# Altium schematic sheet PCIe_to_M2E.SchDoc
size C
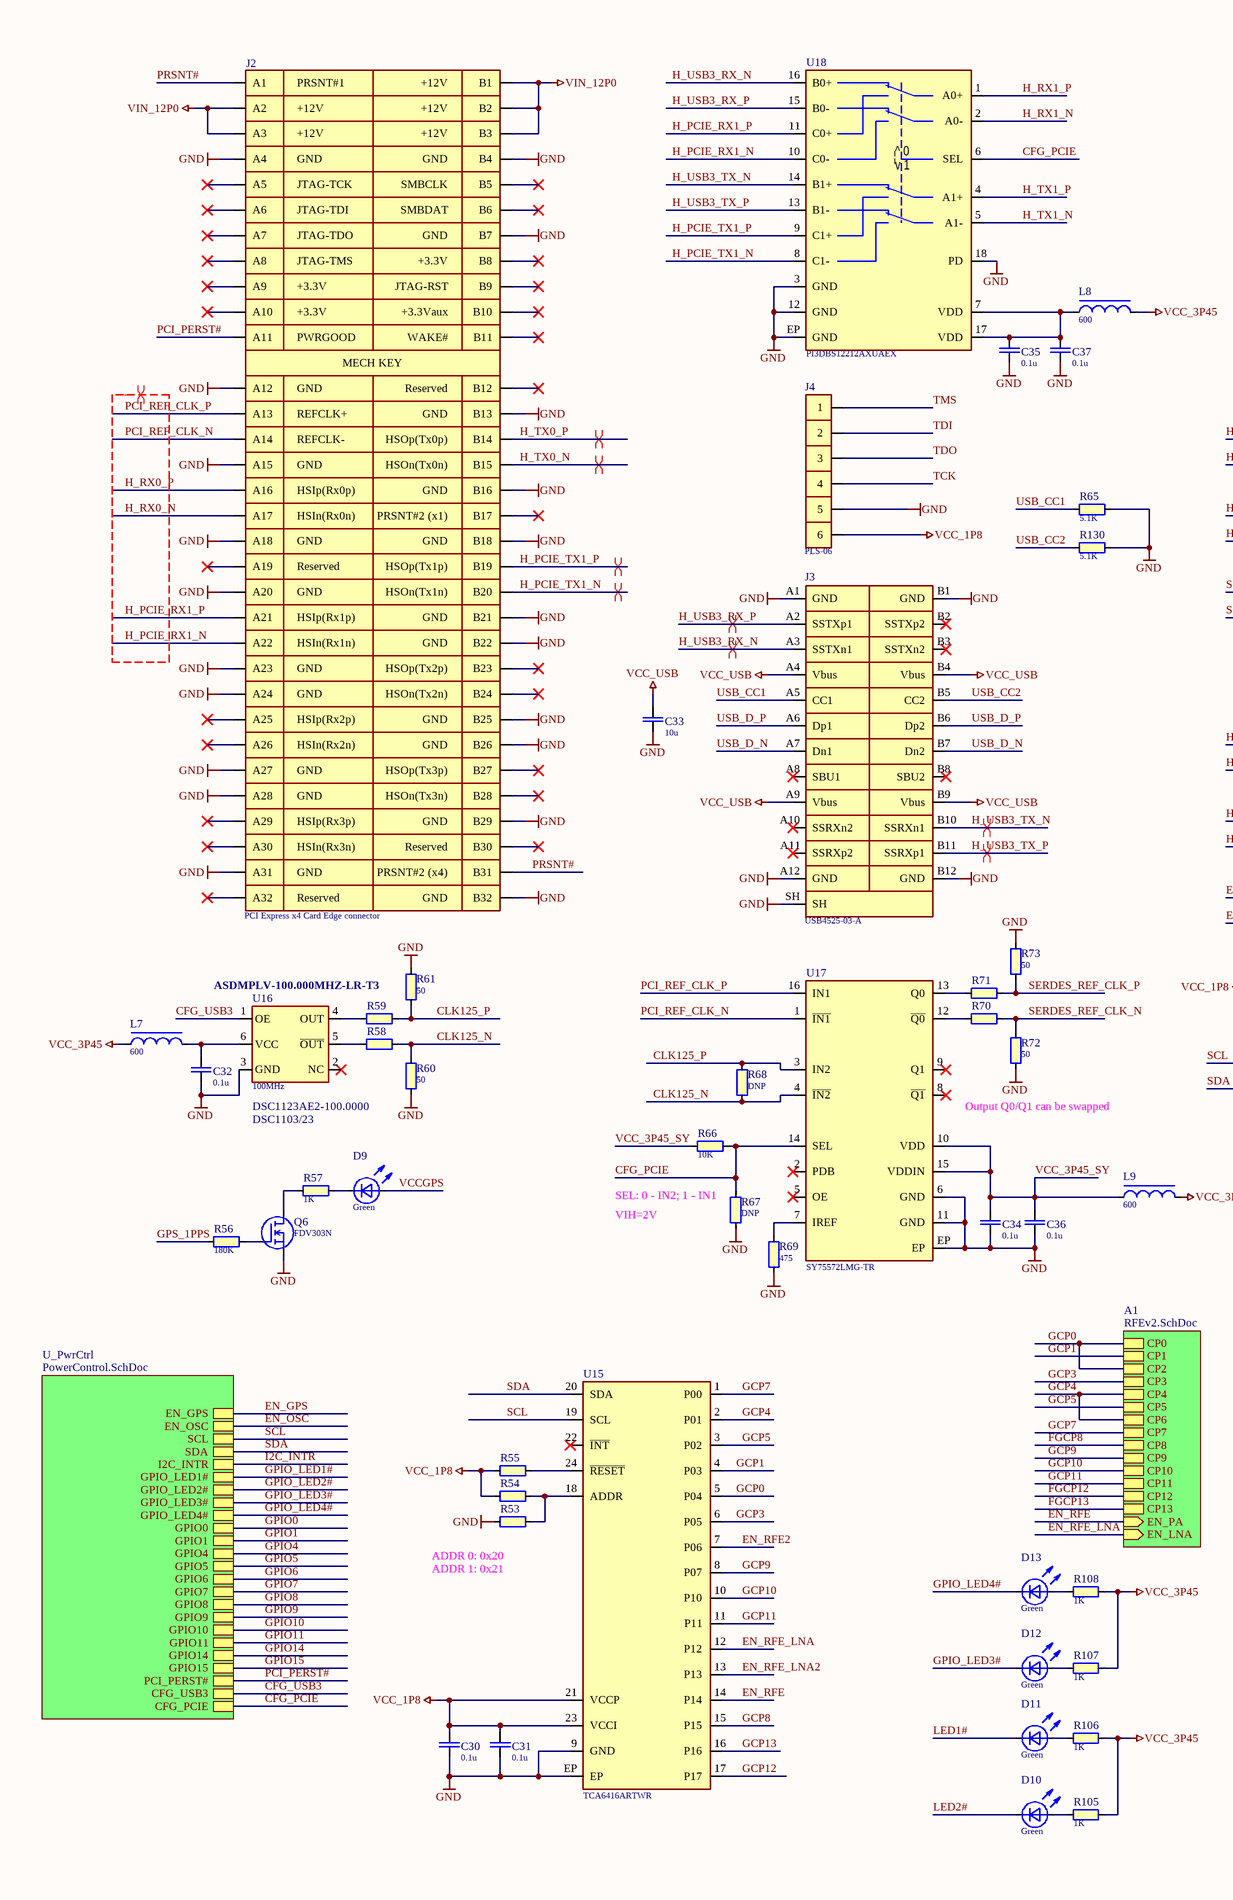
[diagram p0: PCIe_to_M2E.SchDoc, left]
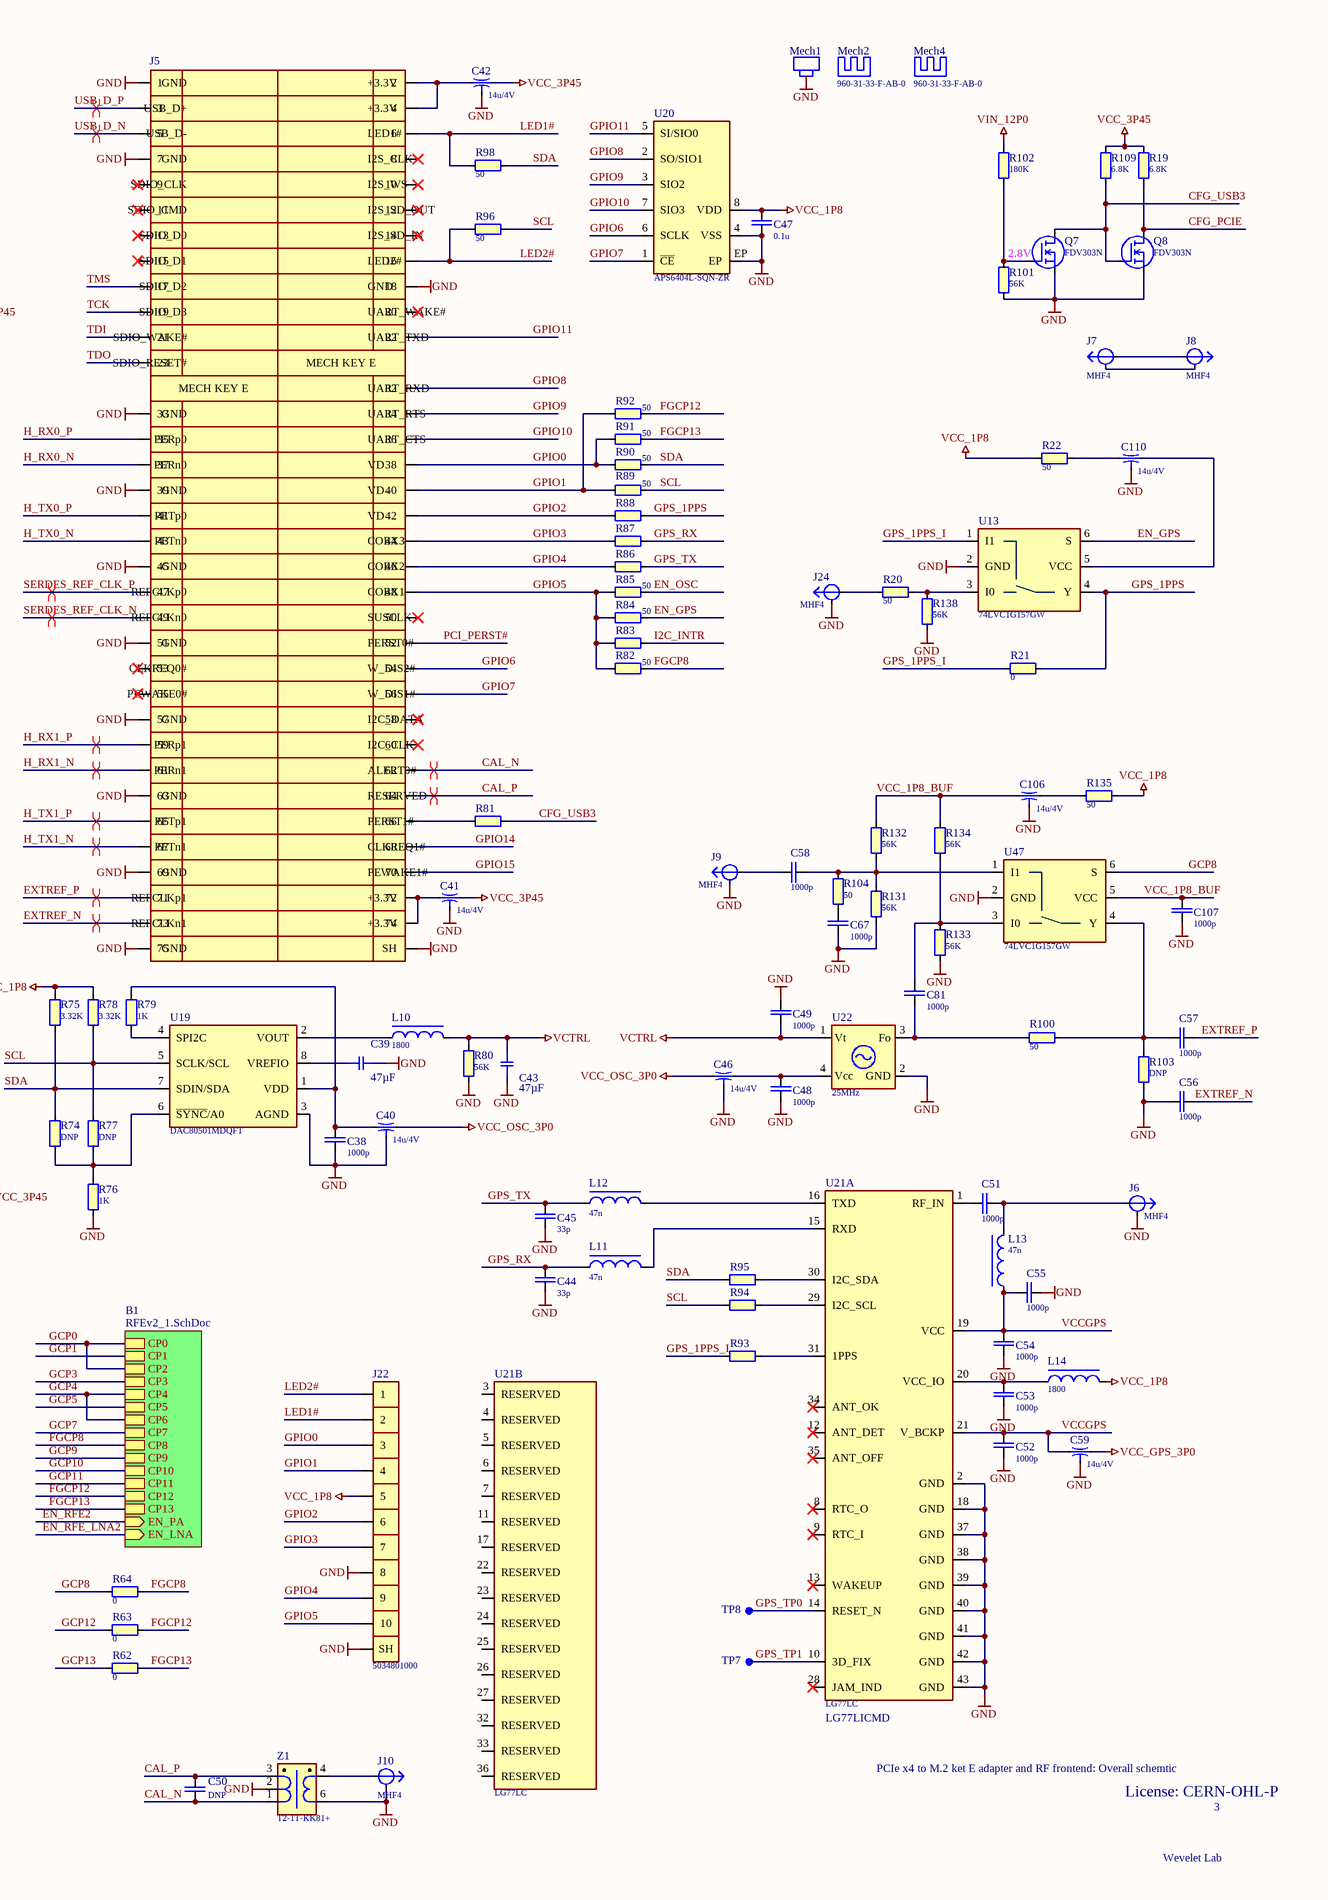
[diagram p1: PCIe_to_M2E.SchDoc, right]

## Parts
C30  value 0.1u  [CAPC100X50X55L25N]  (hidden comment: GRM155R71E104KE14D)
C31  value 0.1u  [CAPC100X50X55L25N]  (hidden comment: GRM155R71E104KE14D)
C32  value 0.1u  [CAPC100X50X55L25N]  (hidden comment: GRM155R71E104KE14D)
C33  value 10u  [CAPC160X80X100L40N]  (hidden comment: Cap-0603-X5R-25V-10u-20%)
C34  value 0.1u  [CAPC100X50X55L25N]  (hidden comment: GRM155R71E104KE14D)
C35  value 0.1u  [CAPC100X50X55L25N]  (hidden comment: GRM155R71E104KE14D)
C36  value 0.1u  [CAPC100X50X55L25N]  (hidden comment: GRM155R71E104KE14D)
C37  value 0.1u  [CAPC100X50X55L25N]  (hidden comment: GRM155R71E104KE14D)
C38  value 1000p  [CAPC100X50X55L25N]  (hidden comment: Cap-0402-NP0-50V-1000p-20%)
C39  value 47µF  [SMD-0603-CAP_HighDensity]  (hidden comment: GRM188C80G476ME01D)
C40  value 14u/4V  [CAPCEMI100X50X50L20N]  (hidden comment: NFM15PC146R0G3D)
C41  value 14u/4V  [CAPCEMI100X50X50L20N]  (hidden comment: NFM15PC146R0G3D)
C42  value 14u/4V  [CAPCEMI100X50X50L20N]  (hidden comment: NFM15PC146R0G3D)
C43  value 47µF  [SMD-0603-CAP_HighDensity]  (hidden comment: GRM188C80G476ME01D)
C44  value 33p  [CAPC100X50X55L25N]  (hidden comment: Cap-0402-NP0-50V-33p-20%)
C45  value 33p  [CAPC100X50X55L25N]  (hidden comment: Cap-0402-NP0-50V-33p-20%)
C46  value 14u/4V  [CAPCEMI100X50X50L20N]  (hidden comment: NFM15PC146R0G3D)
C47  value 0.1u  [CAPC100X50X55L25N]  (hidden comment: GRM155R71E104KE14D)
C48  value 1000p  [CAPC100X50X55L25N]  (hidden comment: Cap-0402-NP0-50V-1000p-20%)
C49  value 1000p  [CAPC100X50X55L25N]  (hidden comment: Cap-0402-NP0-50V-1000p-20%)
C50  value DNP  [CAPC100X50X55L25N]  (hidden comment: Cap-0402-DNP)  (no BOM)
C51  value 1000p  [CAPC100X50X55L25N]  (hidden comment: Cap-0402-NP0-50V-1000p-20%)
C52  value 1000p  [CAPC100X50X55L25N]  (hidden comment: Cap-0402-NP0-50V-1000p-20%)
C53  value 1000p  [CAPC100X50X55L25N]  (hidden comment: Cap-0402-NP0-50V-1000p-20%)
C54  value 1000p  [CAPC100X50X55L25N]  (hidden comment: Cap-0402-NP0-50V-1000p-20%)
C55  value 1000p  [CAPC100X50X55L25N]  (hidden comment: Cap-0402-NP0-50V-1000p-20%)
C56  value 1000p  [CAPC100X50X55L25N]  (hidden comment: Cap-0402-NP0-50V-1000p-20%)
C57  value 1000p  [CAPC100X50X55L25N]  (hidden comment: Cap-0402-NP0-50V-1000p-20%)
C58  value 1000p  [CAPC100X50X55L25N]  (hidden comment: Cap-0402-NP0-50V-1000p-20%)
C59  value 14u/4V  [CAPCEMI100X50X50L20N]  (hidden comment: NFM15PC146R0G3D)
C67  value 1000p  [CAPC100X50X55L25N]  (hidden comment: Cap-0402-NP0-50V-1000p-20%)
C81  value 1000p  [CAPC100X50X55L25N]  (hidden comment: Cap-0402-NP0-50V-1000p-20%)
C106  value 14u/4V  [CAPCEMI100X50X50L20N]  (hidden comment: NFM15PC146R0G3D)
C107  value 1000p  [CAPC100X50X55L25N]  (hidden comment: Cap-0402-NP0-50V-1000p-20%)
C110  value 14u/4V  [CAPCEMI100X50X50L20N]  (hidden comment: NFM15PC146R0G3D)
D9  value Green  [LEDC160X80X80L40N-Green]  (hidden comment: LTST-C190KGKT)
D10  value Green  [LEDC160X80X80L40N-Green]  (hidden comment: LTST-C190KGKT)
D11  value Green  [LEDC160X80X80L40N-Green]  (hidden comment: LTST-C190KGKT)
D12  value Green  [LEDC160X80X80L40N-Green]  (hidden comment: LTST-C190KGKT)
D13  value Green  [LEDC160X80X80L40N-Green]  (hidden comment: LTST-C190KGKT)
J2  value PCI Express x4 Card Edge connector  [EDGE_CONN_PCIe_x4]  (hidden comment: Edge connector PCIe x4 Card)  (no BOM)
J3  USB4525-03-A  [GCT_USB4525-03-A]
J4  PLS-06  [PLS-06]
J5  SM3ZS067U215AER1500  [JAE_SM3ZS067U215AER1500]  (value not drawn)
J6  value MHF4  [LINX_CONMHF4-SMD-G-T]  (hidden comment: CONMHF4-SMD-G-T)
J7  value MHF4  [LINX_CONMHF4-SMD-G-T]  (hidden comment: CONMHF4-SMD-G-T)
J8  value MHF4  [LINX_CONMHF4-SMD-G-T]  (hidden comment: CONMHF4-SMD-G-T)
J9  value MHF4  [LINX_CONMHF4-SMD-G-T]  (hidden comment: CONMHF4-SMD-G-T)
J10  value MHF4  [LINX_CONMHF4-SMD-G-T]  (hidden comment: CONMHF4-SMD-G-T)
J22  5034801000  [MOLEX_5034801000]
J24  value MHF4  [LINX_CONMHF4-SMD-G-T]  (hidden comment: CONMHF4-SMD-G-T)
L7  value 600  [INDC100X60X60L30N]  (hidden comment: BLM15HG601SN1D)
L8  value 600  [INDC100X60X60L30N]  (hidden comment: BLM15HG601SN1D)
L9  value 600  [INDC100X60X60L30N]  (hidden comment: BLM15HG601SN1D)
L10  value 1800  [INDC100X60X60L30N]  (hidden comment: BLM15HD182SN1D)
L11  value 47n  [INDC100X60X60L30N]  (hidden comment: LQW15AN47NJ8ZD)
L12  value 47n  [INDC100X60X60L30N]  (hidden comment: LQW15AN47NJ8ZD)
L13  value 47n  [INDC100X60X60L30N]  (hidden comment: LQW15AN47NJ8ZD)
L14  value 1800  [INDC100X60X60L30N]  (hidden comment: BLM15HD182SN1D)
Mech1  SM3ZS067U215-NUT1-R2500  [JAE_SM3ZS067U215-NUT1]  (value not drawn)
Mech2  960-31-33-F-AB-0  [WAKEFIELD_960-31-33-F-AB-0]
Mech4  960-31-33-F-AB-0  [WAKEFIELD_960-31-33-F-AB-0]
Q6  FDV303N  [SOT23-3P95_245X110L45X44N]
Q7  FDV303N  [SOT23-3P95_245X110L45X44N]
Q8  FDV303N  [SOT23-3P95_245X110L45X44N]
R19  value 6.8K  [RESC100X50X40L20N]  (hidden comment: RC0402FR-076K8L)
R20  value 50  [RESC100X50X40L20N]  (hidden comment: RC0402FR-0750RL)
R21  value 0  [RESC100X50X40L20N]  (hidden comment: RC0402JR-070RL)
R22  value 50  [RESC100X50X40L20N]  (hidden comment: RC0402FR-0750RL)
R53  value 33  [RESC100X50X40L20N]  (hidden comment: RC0402FR-0733RL)
R54  value 0  [RESC100X50X40L20N]  (hidden comment: RC0402JR-070RL)
R55  value 6.8K  [RESC100X50X40L20N]  (hidden comment: RC0402FR-076K8L)
R56  value 180K  [RESC100X50X40L20N]  (hidden comment: RC0402FR-07180KL)
R57  value 1K  [RESC100X50X40L20N]  (hidden comment: RC0402FR-071KL)
R58  value 33  [RESC100X50X40L20N]  (hidden comment: RC0402FR-0733RL)
R59  value 33  [RESC100X50X40L20N]  (hidden comment: RC0402FR-0733RL)
R60  value 50  [RESC100X50X40L20N]  (hidden comment: RC0402FR-0750RL)
R61  value 50  [RESC100X50X40L20N]  (hidden comment: RC0402FR-0750RL)
R62  value 0  [RESC100X50X40L20N]  (hidden comment: RC0402JR-070RL)
R63  value 0  [RESC100X50X40L20N]  (hidden comment: RC0402JR-070RL)
R64  value 0  [RESC100X50X40L20N]  (hidden comment: RC0402JR-070RL)
R65  value 5.1K  [RESC100X50X40L20N]  (hidden comment: RC0402FR-075K1L)
R66  value 10K  [RESC100X50X40L20N]  (hidden comment: RC0402FR-0710KL)
R67  value DNP  [RESC100X50X40L20N]  (hidden comment: Res-0402-DNP)  (no BOM)
R68  value DNP  [RESC100X50X40L20N]  (hidden comment: Res-0402-DNP)  (no BOM)
R69  value 475  [RESC100X50X40L20N]  (hidden comment: RC0402FR-07475RL)
R70  value 33  [RESC100X50X40L20N]  (hidden comment: RC0402FR-0733RL)
R71  value 33  [RESC100X50X40L20N]  (hidden comment: RC0402FR-0733RL)
R72  value 50  [RESC100X50X40L20N]  (hidden comment: RC0402FR-0750RL)
R73  value 50  [RESC100X50X40L20N]  (hidden comment: RC0402FR-0750RL)
R74  value DNP  [RESC100X50X40L20N]  (hidden comment: Res-0402-DNP)  (no BOM)
R75  value 3.32K  [RESC100X50X40L20N]  (hidden comment: RC0402FR-073K32L)
R76  value 1K  [RESC100X50X40L20N]  (hidden comment: RC0402FR-071KL)
R77  value DNP  [RESC100X50X40L20N]  (hidden comment: Res-0402-DNP)  (no BOM)
R78  value 3.32K  [RESC100X50X40L20N]  (hidden comment: RC0402FR-073K32L)
R79  value 1K  [RESC100X50X40L20N]  (hidden comment: RC0402FR-071KL)
R80  value 56K  [RESC100X50X40L20N]  (hidden comment: RC0402FR-0756KL)
R81  value 50  [RESC100X50X40L20N]  (hidden comment: RC0402FR-0750RL)
R82  value 50  [RESC100X50X40L20N]  (hidden comment: RC0402FR-0750RL)
R83  value 50  [RESC100X50X40L20N]  (hidden comment: RC0402FR-0750RL)
R84  value 50  [RESC100X50X40L20N]  (hidden comment: RC0402FR-0750RL)
R85  value 50  [RESC100X50X40L20N]  (hidden comment: RC0402FR-0750RL)
R86  value 50  [RESC100X50X40L20N]  (hidden comment: RC0402FR-0750RL)
R87  value 50  [RESC100X50X40L20N]  (hidden comment: RC0402FR-0750RL)
R88  value 50  [RESC100X50X40L20N]  (hidden comment: RC0402FR-0750RL)
R89  value 50  [RESC100X50X40L20N]  (hidden comment: RC0402FR-0750RL)
R90  value 50  [RESC100X50X40L20N]  (hidden comment: RC0402FR-0750RL)
R91  value 50  [RESC100X50X40L20N]  (hidden comment: RC0402FR-0750RL)
R92  value 50  [RESC100X50X40L20N]  (hidden comment: RC0402FR-0750RL)
R93  value 50  [RESC100X50X40L20N]  (hidden comment: RC0402FR-0750RL)
R94  value 50  [RESC100X50X40L20N]  (hidden comment: RC0402FR-0750RL)
R95  value 50  [RESC100X50X40L20N]  (hidden comment: RC0402FR-0750RL)
R96  value 50  [RESC100X50X40L20N]  (hidden comment: RC0402FR-0750RL)
R98  value 50  [RESC100X50X40L20N]  (hidden comment: RC0402FR-0750RL)
R100  value 50  [RESC100X50X40L20N]  (hidden comment: RC0402FR-0750RL)
R101  value 56K  [RESC100X50X40L20N]  (hidden comment: RC0402FR-0756KL)
R102  value 180K  [RESC100X50X40L20N]  (hidden comment: RC0402FR-07180KL)
R103  value DNP  [RESC100X50X40L20N]  (hidden comment: Res-0402-DNP)  (no BOM)
R104  value 50  [RESC100X50X40L20N]  (hidden comment: RC0402FR-0750RL)
R105  value 1K  [RESC100X50X40L20N]  (hidden comment: RC0402FR-071KL)
R106  value 1K  [RESC100X50X40L20N]  (hidden comment: RC0402FR-071KL)
R107  value 1K  [RESC100X50X40L20N]  (hidden comment: RC0402FR-071KL)
R108  value 1K  [RESC100X50X40L20N]  (hidden comment: RC0402FR-071KL)
R109  value 6.8K  [RESC100X50X40L20N]  (hidden comment: RC0402FR-076K8L)
R130  value 5.1K  [RESC100X50X40L20N]  (hidden comment: RC0402FR-075K1L)
R131  value 56K  [RESC100X50X40L20N]  (hidden comment: RC0402FR-0756KL)
R132  value 56K  [RESC100X50X40L20N]  (hidden comment: RC0402FR-0756KL)
R133  value 56K  [RESC100X50X40L20N]  (hidden comment: RC0402FR-0756KL)
R134  value 56K  [RESC100X50X40L20N]  (hidden comment: RC0402FR-0756KL)
R135  value 50  [RESC100X50X40L20N]  (hidden comment: RC0402FR-0750RL)
R138  value 56K  [RESC100X50X40L20N]  (hidden comment: RC0402FR-0756KL)
TP7  TP100  [TP100]  (value not drawn)  (no BOM)
TP8  TP100  [TP100]  (value not drawn)  (no BOM)
U13  74LVC1G157GW  [SOT363-2P95_200X125L45X40N]
U15  TCA6416ARTWR  [QFN25P50_400X400X80L40X24T250N]
U16  value 100MHz  [ABRACON_AK2A]  (hidden comment: AK2ADDF1-100.000T)
U17  SY75572LMG-TR  [QFN17P50_300X300X100L40X24T170N]
U18  PI3DBS12212AXUAEX  [QFN19P40_200X200X40L25X20T100N]
U19  DAC80501MDQFT  [SON8P50_200X200X80L50X25N]
U20  APS6404L-SQN-ZR  [PSON9P50_200X300X50L45X25T160X20N]
U21  value LG77LC  [QUECTEL_LG77LC]  (hidden comment: LG77LICMD)  (parts A,B of 2)
U22  value 25MHz  [OSCCC320X250X100L70X80N]  (hidden comment: TXEAADSANF-25.000000)
U47  74LVC1G157GW  [SOT363-2P95_200X125L45X40N]
Z1  T2-1T-KK81+  [Mini-Circuits_KK81]

## Sub-sheets
A1 = RFEv2.SchDoc: CP0, CP1, CP3, CP2, CP4, CP5, CP6, CP7, CP9, CP10, CP11, CP12, CP13, CP8, EN_PA (in), EN_LNA (in)
B1 = RFEv2_1.SchDoc: CP0, CP1, CP3, CP2, CP4, CP5, CP6, CP7, CP9, CP10, CP11, CP12, CP13, CP8, EN_PA (in), EN_LNA (in)
U_PwrCtrl = PowerControl.SchDoc: EN_GPS, EN_OSC, SCL, SDA, I2C_INTR, GPIO_LED1#, GPIO_LED2#, GPIO_LED3#, GPIO_LED4#, GPIO0, GPIO1, GPIO4, GPIO5, GPIO6, GPIO7, GPIO8, GPIO9, GPIO10, GPIO11, GPIO14, GPIO15, PCI_PERST#, CFG_USB3, CFG_PCIE

## Nets
GND: C30.2 C31.2 C32.2 C33.2 C34.2 C35.2 C36.2 C37.2 C38.1 C39.2 C40.2(GND) C41.2(GND) C42.2(GND) C43.2 C44.2 C45.2 C46.2(GND) C47.2 C48.1 C49.2 C52.2 C53.1 C54.2 C55.1 C56.1 C59.2(GND) C67.2 C106.2(GND) C107.1 C110.2(GND) J2.A4 J2.A12 J2.A15 J2.A18 J2.A20 J2.A23 J2.A24 J2.A27 J2.A28 J2.A31 J2.B4 J2.B7 J2.B13 J2.B16 J2.B18 J2.B21 J2.B22 J2.B25 J2.B26 J2.B29 J2.B32 J3.A1(GND) J3.A12(GND) J3.B1(GND) J3.B12(GND) J3.SH J4.5 J5.1 J5.7 J5.18 J5.33 J5.39 J5.45 J5.51 J5.57 J5.63 J5.69 J5.75 J5.SH J6.SH J9.SH J10.SH J22.8 J22.SH J24.SH Mech1.SH Q6.2(S) Q7.2(S) Q8.2(S) R53.1 R60.1 R61.2 R65.2 R67.1 R69.1 R72.1 R73.2 R76.1 R80.2 R101.1 R103.1 R130.2 R131.2 R133.2 R138.2 U13.2(GND) U15.9(GND) U15.EP U16.3(GND) U17.6(GND) U17.11(GND) U17.EP U18.3(GND) U18.12(GND) U18.18(PD) U18.EP(GND) U19.3(AGND) U20.4(VSS) U20.EP U21.2(GND) U21.18(GND) U21.37(GND) U21.38(GND) U21.39(GND) U21.40(GND) U21.41(GND) U21.42(GND) U21.43(GND) U22.2(GND) U47.2(GND) Z1.2(SEC-CT) Z1.6(PRI)
VCC_1P8: C30.1 C31.1 C47.1 J4.6 J22.5 L14.2 R22.2 R54.1 R55.1 R75.2 R78.2 R135.1 U15.21(VCCP) U15.23(VCCI) U20.8(VDD)
VCC_3P45: C41.3 C42.3 L7.1 L8.2 L9.2 R19.2 R105.2 R106.2 R107.2 R108.2 R109.2
VCC_GPS_3P0: C59.3
VCC_OSC_3P0: C40.3 C46.1
VCC_USB: C33.1 J3.A4(Vbus) J3.A9(Vbus) J3.B4(Vbus) J3.B9(Vbus)
VCTRL: C43.1 C49.1 L10.2 R80.1 U22.1(Vt)
VIN_12P0: J2.A2 J2.A3 J2.B1 J2.B2 J2.B3 R102.2
CAL_N: C50.2 J5.62 Z1.1(SEC)
CAL_P: C50.1 J5.64 Z1.3(SEC-DOT)
CFG_PCIE: Q8.3(D) R19.1 R66.1 R67.2 U17.14(SEL) U18.6(SEL) ; sheet U_PwrCtrl/CFG_PCIE
CFG_USB3: Q7.3(D) Q8.1(G) R81.2 R109.1 U16.1(OE) ; sheet U_PwrCtrl/CFG_USB3
CLK125_N: R58.2 R60.2 R68.1 U17.4(~{IN2})
CLK125_P: R59.2 R61.1 R68.2 U17.3(IN2)
EN_GPS: R84.2 U13.6(S) ; sheet U_PwrCtrl/EN_GPS
EN_OSC: R85.2 ; sheet U_PwrCtrl/EN_OSC
EN_RFE: U15.14(P14) ; sheet A1/EN_PA
EN_RFE2: U15.7(P06) ; sheet B1/EN_PA
EN_RFE_LNA: U15.12(P12) ; sheet A1/EN_LNA
EN_RFE_LNA2: U15.13(P13) ; sheet B1/EN_LNA
EXTREF_N: C56.2 J5.73
EXTREF_P: C57.2 J5.71
FGCP8: R64.2 R82.2 ; sheet A1/CP8, sheet B1/CP8
FGCP12: R63.2 R92.2 ; sheet A1/CP12, sheet B1/CP12
FGCP13: R62.2 R91.2 ; sheet A1/CP13, sheet B1/CP13
GCP0: U15.5(P04) ; sheet A1/CP0, sheet A1/CP2, sheet B1/CP0, sheet B1/CP2
GCP1: U15.4(P03) ; sheet A1/CP1, sheet B1/CP1
GCP3: U15.6(P05) ; sheet A1/CP3, sheet B1/CP3
GCP4: U15.2(P01) ; sheet A1/CP4, sheet A1/CP6, sheet B1/CP4, sheet B1/CP6
GCP5: U15.3(P02) ; sheet A1/CP5, sheet B1/CP5
GCP7: U15.1(P00) ; sheet A1/CP7, sheet B1/CP7
GCP8: R64.1 U15.15(P15) U47.6(S)
GCP9: U15.8(P07) ; sheet A1/CP9, sheet B1/CP9
GCP10: U15.10(P10) ; sheet A1/CP10, sheet B1/CP10
GCP11: U15.11(P11) ; sheet A1/CP11, sheet B1/CP11
GCP12: R63.1 U15.17(P17)
GCP13: R62.1 U15.16(P16)
GPIO0: J5.38 J22.3 R90.1 R91.1 ; sheet U_PwrCtrl/GPIO0
GPIO1: J5.40 J22.4 R89.1 R92.1 ; sheet U_PwrCtrl/GPIO1
GPIO2: J5.42 J22.6 R88.1
GPIO3: J5.44 J22.7 R87.1
GPIO4: J5.46 J22.9 R86.1 ; sheet U_PwrCtrl/GPIO4
GPIO5: J5.48 J22.10 R82.1 R83.1 R84.1 R85.1 ; sheet U_PwrCtrl/GPIO5
GPIO6: J5.54 U20.6(SCLK) ; sheet U_PwrCtrl/GPIO6
GPIO7: J5.56 U20.1(~{CE}) ; sheet U_PwrCtrl/GPIO7
GPIO8: J5.32 U20.2(SO/SIO1) ; sheet U_PwrCtrl/GPIO8
GPIO9: J5.34 U20.3(SIO2) ; sheet U_PwrCtrl/GPIO9
GPIO10: J5.36 U20.7(SIO3) ; sheet U_PwrCtrl/GPIO10
GPIO11: J5.22 U20.5(SI/SIO0) ; sheet U_PwrCtrl/GPIO11
GPIO14: J5.68 ; sheet U_PwrCtrl/GPIO14
GPIO15: J5.70 ; sheet U_PwrCtrl/GPIO15
GPIO_LED1#: sheet U_PwrCtrl/GPIO_LED1#
GPIO_LED2#: sheet U_PwrCtrl/GPIO_LED2#
GPIO_LED3#: D12.C ; sheet U_PwrCtrl/GPIO_LED3#
GPIO_LED4#: D13.C ; sheet U_PwrCtrl/GPIO_LED4#
GPS_1PPS: R21.2 R56.1 R88.2 U13.4(Y)
GPS_1PPS_I: R21.1 R93.1 U13.1(I1)
GPS_RX: C44.1 L11.1 R87.2
GPS_TP0: TP8.1 U21.14(RESET_N)
GPS_TP1: TP7.1 U21.10(3D_FIX)
GPS_TX: C45.1 L12.1 R86.2
H_PCIE_RX1_N: J2.A22 U18.10(C0-)
H_PCIE_RX1_P: J2.A21 U18.11(C0+)
H_PCIE_TX1_N: J2.B20 U18.8(C1-)
H_PCIE_TX1_P: J2.B19 U18.9(C1+)
H_RX0_N: J2.A17 J5.37
H_RX0_P: J2.A16 J5.35
H_RX1_N: J5.61 U18.2(A0-)
H_RX1_P: J5.59 U18.1(A0+)
H_TX0_N: J2.B15 J5.43
H_TX0_P: J2.B14 J5.41
H_TX1_N: J5.67 U18.5(A1-)
H_TX1_P: J5.65 U18.4(A1+)
H_USB3_RX_N: J3.A3(SSTXn1) U18.16(B0+)
H_USB3_RX_P: J3.A2(SSTXp1) U18.15(B0-)
H_USB3_TX_N: J3.B10(SSRXn1) U18.14(B1+)
H_USB3_TX_P: J3.B11(SSRXp1) U18.13(B1-)
I2C_INTR: R83.2 ; sheet U_PwrCtrl/I2C_INTR
LED1#: D11.C J5.6 J22.2 R98.1
LED2#: D10.C J5.16 J22.1 R96.1
PCI_PERST#: J2.A11 J5.52 ; sheet U_PwrCtrl/PCI_PERST#
PCI_REF_CLK_N: J2.A14 U17.1(~{IN1})
PCI_REF_CLK_P: J2.A13 U17.16(IN1)
PRSNT#: J2.A1 J2.B31
SCL: R77.2 R78.1 R89.2 R94.1 R96.2 U15.19(SCL) U19.5(SCLK/SCL) ; sheet U_PwrCtrl/SCL
SDA: R74.2 R75.1 R90.2 R95.1 R98.2 U15.20(SDA) U19.7(SDIN/SDA) ; sheet U_PwrCtrl/SDA
SERDES_REF_CLK_N: J5.49 R70.2 R72.2
SERDES_REF_CLK_P: J5.47 R71.2 R73.1
TCK: J4.4 J5.19
TDI: J4.2 J5.21
TDO: J4.3 J5.23
TMS: J4.1 J5.17
USB_CC1: J3.A5(CC1) R65.1
USB_CC2: J3.B5(CC2) R130.1
USB_D_N: J3.A7(Dn1) J3.B7(Dn2) J5.5
USB_D_P: J3.A6(Dp1) J3.B6(Dp2) J5.3
VCC_1P8_BUF: C106.1 C107.2 R132.1 R134.1 U47.5(VCC)
VCC_3P45_SY: C34.1 C36.1 L9.1 R66.2 U17.10(VDD) U17.15(VDDIN)
VCCGPS: C52.1 C54.1 C55.2 C59.1 D9.A L13.1 U21.19(VCC) U21.21(V_BCKP)
NetC32_1: C32.1 L7.2 U16.6(VCC)
NetC35_1: C35.1 C37.1 L8.1 U18.7(VDD) U18.17(VDD)
NetC38_2: C38.2 C40.1 R79.2 U19.1(VDD)
NetC39_1: C39.1 U19.8(VREFIO)
NetC41_1: C41.1 J5.72 J5.74
NetC42_1: C42.1 J5.2 J5.4
NetC46_3: C46.3 C48.2 U22.4(Vcc)
NetC51_1: C51.1 J6.1 L13.2
NetC51_2: C51.2 U21.1(RF_IN)
NetC53_2: C53.2 L14.1 U21.20(VCC_IO)
NetC57_1: C57.1 R100.2 R103.2 U47.4(Y)
NetC58_1: C58.1 R104.2 R131.1 R132.2 U47.1(I1)
NetC58_2: C58.2 J9.1
NetC67_1: C67.1 R104.1
NetC81_1: C81.1 R133.1 R134.2 U47.3(I0)
NetC81_2: C81.2 R100.1 U22.3(Fo)
NetC106_3: C106.3 R135.2
NetC110_1: C110.1 R22.1
NetC110_3: C110.3 U13.5(VCC)
NetD9_C: D9.C R57.1
NetD10_A: D10.A R105.1
NetD11_A: D11.A R106.1
NetD12_A: D12.A R107.1
NetD13_A: D13.A R108.1
NetJ5_66: J5.66 R81.1
NetJ7_1: J7.1 J8.1
NetJ7_SH: J7.SH J8.SH
NetJ10_1: J10.1 Z1.4(PRI-DOT)
NetJ24_1: J24.1 R20.2
NetL10_1: L10.1 U19.2(VOUT)
NetL11_2: L11.2 U21.15(RXD)
NetL12_2: L12.2 U21.16(TXD)
NetQ6_1: Q6.1(G) R56.2
NetQ6_3: Q6.3(D) R57.2
NetQ7_1: Q7.1(G) R101.2 R102.1
NetR20_1: R20.1 R138.1 U13.3(I0)
NetR53_2: R53.2 R54.2 U15.18(ADDR)
NetR55_2: R55.2 U15.24(~{RESET})
NetR58_1: R58.1 U16.5(~{OUT})
NetR59_1: R59.1 U16.4(OUT)
NetR69_2: R69.2 U17.7(IREF)
NetR70_1: R70.1 U17.12(~{Q0})
NetR71_1: R71.1 U17.13(Q0)
NetR74_1: R74.1 R76.2 R77.1 U19.6(~{SYNC}/A0)
NetR79_1: R79.1 U19.4(SPI2C)
NetR93_2: R93.2 U21.31(1PPS)
NetR94_2: R94.2 U21.29(I2C_SCL)
NetR95_2: R95.2 U21.30(I2C_SDA)

Not connected (* = marked no-connect by the designer): J2 A5* A6* A7* A8* A9* A10* A19* A25* A26* A29* A30* A32* B5* B6* B8* B9* B10* B11* B12* B17* B23* B24* B27* B28* B30*; J3 A8(SBU1)* A10(SSRXn2)* A11(SSRXp2)* B2(SSTXp2)* B3(SSTXn2)* B8(SBU2)*; J5 8* 9* 10* 11* 12* 13* 14* 15* 20* 50* 53* 55* 58* 60*; Mech2 MH; Mech4 MH; U15 22(~{INT})*; U16 2(NC)*; U17 2(PDB)* 5(OE)* 8(~{Q1})* 9(Q1)*; U21 3(RESERVED) 4(RESERVED) 5(RESERVED) 6(RESERVED) 7(RESERVED) 8(RTC_O)* 9(RTC_I)* 11(RESERVED) 12(ANT_DET)* 13(WAKEUP)* 17(RESERVED) 22(RESERVED) 23(RESERVED) 24(RESERVED) 25(RESERVED) 26(RESERVED) 27(RESERVED) 28(JAM_IND)* 32(RESERVED) 33(RESERVED) 34(ANT_OK)* 35(ANT_OFF)* 36(RESERVED)

## Layout directives
differential pair; differential pair class 100_Ohm: CAL_N, CAL_P, EXTREF_N, EXTREF_P, H_PCIE_RX1_N, H_PCIE_RX1_P, H_PCIE_TX1_N, H_PCIE_TX1_P, H_RX0_N, H_RX0_P, H_RX1_N, H_RX1_P, H_TX0_N, H_TX0_P, H_TX1_N, H_TX1_P, H_USB3_RX_N, H_USB3_RX_P, H_USB3_TX_N, H_USB3_TX_P, PCI_REF_CLK_N, PCI_REF_CLK_P, SERDES_REF_CLK_N, SERDES_REF_CLK_P, USB_D_N, USB_D_P

## Notes on the sheet
- 2.8V
- ASDMPLV-100.000MHZ-LR-T3
- DSC1103/23
- (near U16) DSC1123AE2-100.0000
- Output Q0/Q1 can be swapped
- (near R67) SEL: 0 - IN2; 1 - IN1
- VIH=2V
- (near R53) ADDR 0: 0x20
- (near R53) ADDR 1: 0x21
- (near U21) LG77LICMD
- PCIe x4 to M.2 ket E adapter and RF frontend: Overall schemtic
- License: CERN-OHL-P
- Wevelet Lab
- 3
- (in symbol Edge connector PCIe x4 Card) PRSNT#1; +12V; GND; JTAG-TCK; SMBCLK; JTAG-TDI; SMBDAT; JTAG-TDO; JTAG-TMS; +3.3V; JTAG-RST; +3.3Vaux; PWRGOOD; WAKE#; MECH KEY; Reserved; REFCLK+; REFCLK-; HSOp(Tx0p); HSOn(Tx0n); HSIp(Rx0p); HSIn(Rx0n); PRSNT#2 (x1); HSOp(Tx1p); HSOn(Tx1n); HSIp(Rx1p); HSIn(Rx1n); HSOp(Tx2p); HSOn(Tx2n); HSIp(Rx2p); HSIn(Rx2n); HSOp(Tx3p); HSOn(Tx3n); HSIp(Rx3p); HSIn(Rx3n); PRSNT#2 (x4)
- (in symbol PI3DBS12212AXUAEX) ^ 0; |; v 1
- (in symbol SM3ZS067U215AER1500) GND; +3.3V; USB_D+; USB_D-; LED1#; I2S_CLK; SDIO_CLK; I2S_WS; SDIO_CMD; I2S_SD_OUT; SDIO_D0; I2S_SD_IN; SDIO_D1; LED2#; SDIO_D2; SDIO_D3; UART_WAKE#; SDIO_WAKE#; UART_TXD; SDIO_RESET#; MECH KEY E; UART_RXD; UART_RTS; PERp0; UART_CTS; PERn0; VD; PETp0; PETn0; COEX3; COEX2; REFCLKp0; COEX1; REFCLKn0; SUSCLK; PERST0#; CLKREQ0#; W_DIS2#; PEWAKE0#; W_DIS1#; I2C_DATA; PERp1; I2C_CLK; PERn1; ALERT0#; RESERVED; PETp1; PERST1#; PETn1; CLKREQ1#; PEWAKE1#; REFCLKp1; REFCLKn1

## Library data of the parts
C30-C32 C34-C37 C47 = GRM155R71E104KE14D: Capacitor, 0.1u, 25V, 10%, X7R, 0402; Manufacturer: Murata Electronics
C33 = Cap-0603-X5R-25V-10u-20%: Capacitor, 10u, 25V, 20%, X5R, 0603; Manufacturer: *
C38 C48 C49 C51-C58 C67 C81 C107 = Cap-0402-NP0-50V-1000p-20%: Capacitor, 1000p, 50V, 20%, NP0, 0402; Manufacturer: *
C39 C43 = GRM188C80G476ME01D: CAP CER 47UF 4V X6S 0603; Manufacturer: Murata Electronics North America; Tolerance: ±20%; Datasheets: https://www.murata.com/-/media/webrenewal/support/library/catalog/products/capacitor/ceramiccapacitor/c02e.ashx?la=en-us&cvid=20210120024548000000; Digi-Key Part Number: 490-13246-2-ND; Part Number: GRM188C80G476ME01D; Series: GRM; Part Status: Active; Voltage: 4V; Temperature Coefficient: X6S; Operating Temperature: -55°C ~ 105°C; Applications: General Purpose; Failure Rate: Surface Mount, MLCC; Mounting Type: 0603 (1608 Metric); Package / Case: 0.063" L x 0.031" W (1.60mm x 0.80mm)
C40-C42 C46 C59 C106 C110 = NFM15PC146R0G3D: Capacitor feedthru, 14u, 4V, 20%, 2A, 0402; Manufacturer: Murata Electronics; Name: NFM15PC146R0G3D
C44 C45 = Cap-0402-NP0-50V-33p-20%: Capacitor, 33p, 50V, 20%, NP0, 0402; Manufacturer: *
C50 = Cap-0402-DNP: Capacitor, DNP, 0402; Manufacturer: *
D9-D13 = LTST-C190KGKT: LED Diode, Green, -30/+85, SMD0603; Manufacturer: Lite-On Inc.
J2 = Edge connector PCIe x4 Card: Edge connector PCI Express x4 Card; Manufacturer: *
J3 = USB4525-03-A: Conn, USB-C, USB3.2 gen 2, +25/+85, Right, Trough Hole; Manufacturer: GCT; Value: USB4525-03-A
J4 = PLS-06: Conn, Header 6x1, 2.54mm, Trough Hole; Manufacturer: *; Value: PLS-06
J5 = SM3ZS067U215AER1500: Conn M.2, Key E, -40/+80, SMD; Manufacturer: JAE; Value: SM3ZS067U215AER1500
J6-J10 J24 = CONMHF4-SMD-G-T: Conn, IPEX MHF4, Male Pin, 50 Ohm, -65/+165, SMD; Manufacturer: Linx Technologies Inc.; Name: CONMHF4-SMD-G-T
J22 = 5034801000: Conn, FFC, 10 pins, 0.5mm, -40/+85, Right, SMD; Manufacturer: Molex; Value: 5034801000
L7-L9 = BLM15HG601SN1D: Ferrite bead, 600Ohm@100MHz, 0,3A, 700mOhm, -55/+125, SMD0402; Manufacturer: Murata Electronics; Name: BLM15HG601SN1D
L10 L14 = BLM15HD182SN1D: Ferrite bead, 1800Ohm@100MHz, 0,2A, 2.2Ohm, -55/+125, SMD0402; Manufacturer: Murata Electronics; Name: BLM15HD182SN1D
L11-L13 = LQW15AN47NJ8ZD: Inductor, 47n, 0,44A, 648mOhm, +/-5%, -55/+125, SMD0402; Manufacturer: Murata; Name: LQW15AN47NJ8ZD
Mech1 = SM3ZS067U215-NUT1-R2500: Mech, standoff, M2, 0.35 mm; Manufacturer: JAE; Value: SM3ZS067U215-NUT1-R2500
Mech2 Mech4 = 960-31-33-F-AB-0: Mech, Heatsink, 31x33 mm, front, push pins; Manufacturer: Wakefield; Value: 960-31-33-F-AB-0
Q6-Q8 = FDV303N: Transistor, MOSFET, N-CH, 25V, 0.68A, -55/+150, SOT-23; Manufacturer: Onsemi; Value: FDV303N
R19 R55 R109 = Res-0402-6.8K-1%: Resistor, 6.8K, 0.063W, 1%, 0402; Manufacturer: *; Name: RC0402FR-076K8L
R20 R22 R60 R61 R72 R73 R81-R96 R98 R100 R104 R135 = Res-0402-50-5%: Resistor, 50, 0.063W, 5%, 0402; Manufacturer: *; Name: RC0402FR-0750RL
R21 R54 R62-R64 = Res-0402-0-5%: Resistor, 0, 0.063W, 5%, 0402; Manufacturer: *; Name: RC0402JR-070RL
R53 R58 R59 R70 R71 = Res-0402-33-5%: Resistor, 33, 0.063W, 5%, 0402; Manufacturer: *; Name: RC0402FR-0733RL
R56 R102 = Res-0402-180K-1%: Resistor, 180K, 0.063W, 1%, 0402; Manufacturer: *; Name: RC0402FR-07180KL
R57 R76 R79 R105-R108 = Res-0402-1K-5%: Resistor, 1K, 0.063W, 5%, 0402; Manufacturer: *; Name: RC0402FR-071KL
R65 R130 = Res-0402-5.1K-1%: Resistor, 5.1K, 0.063W, 1%, 0402; Manufacturer: *; Name: RC0402FR-075K1L
R66 = Res-0402-10K-5%: Resistor, 10K, 0.063W, 5%, 0402; Manufacturer: *; Name: RC0402FR-0710KL
R67 R68 R74 R77 R103 = Res-0402-DNP: Resistor, DNP, 0.063W, 5%, 0402; Manufacturer: *
R69 = Res-0402-475-5%: Resistor, 475, 0.063W, 5%, 0402; Manufacturer: *; Name: RC0402FR-07475RL
R75 R78 = Res-0402-3.32K-1%: Resistor, 3.32K, 0.063W, 1%, 0402; Manufacturer: *; Name: RC0402FR-073K32L
R80 R101 R131-R134 R138 = Res-0402-56K-5%: Resistor, 56K, 0.063W, 5%, 0402; Manufacturer: *; Name: RC0402FR-0756KL
TP7 TP8 = TP100: Solder point, Surface, 1 mm; Manufacturer: *; Value: *
U13 U47 = 74LVC1G157GW: IC, Single 2-input multiplexer, 1.1-5.5V, -40/+125, SOT363-2; Manufacturer: Nexperia; Value: 74LVC1G157GW
U15 = TCA6416ARTWR: IC, Expander, 16-bit, 400KHZ, I2C, SMBUS, 1.65-5.5V, -40/+85, 24-WQFN (4x4); Manufacturer: TI; Value: TCA6416ARTWR
U16 = AK2ADDF1-100.000T: Oscillators, 100MHz, 2.375/3.63V, 25ppm, -40/+85, SMD; Manufacturer: ABRACON
U17 = SY75572LMG-TR: IC, CLK BUFFRT, 2:2, 267MHz, -40/+85, / 16-QFN; Manufacturer: Microchip Technology; Value: SY75572LMG-TR
U18 = PI3DBS12212AXUAEX: IC, MUS/DEMUX, 2:1, 12GBPS, -40/+85, 18-X2QFN; Manufacturer: Diodes Incorporated; Value: PI3DBS12212AXUAEX
U19 = DAC80501MDQFT: IC, DAC, 16-bit, 2.7-5.5V, -40/+125, WSON-8; Manufacturer: TI; Value: DAC80501MDQFT
U20 = APS6404L-SQN-ZR: IC, DRAM, 64Mb, QSPI, SDR 144MHz, 1.8V, -25/+85, USON8; Manufacturer: AP Memory; Value: APS6404L-SQN-ZR
U21 = LG77LC: GNSS module, GPS, GLONASS (or BeiDou), Galileo and QZSS, -40/+85, SMD; Manufacturer: Quectel
U22 = TXEAADSANF-25.000000: Oscillators, VCXO, 25MHz, 3.3/3.0/2.8V, 0.1ppm 0-80dc, 0/+80, SMD; Manufacturer: Taitien; Name: TXEAADSANF-25.000000
Z1 = T2-1T-KK81+: Transformer, 1:2 CORE & WIRE , 0.07 - 200 MHz, 50Ω, SMD; Manufacturer: Mini-Circuits; Value: T2-1T-KK81+